# EAGLE design AVRI2CIO_V0_3_LEVEL0 (EAGLE 6.6.0)
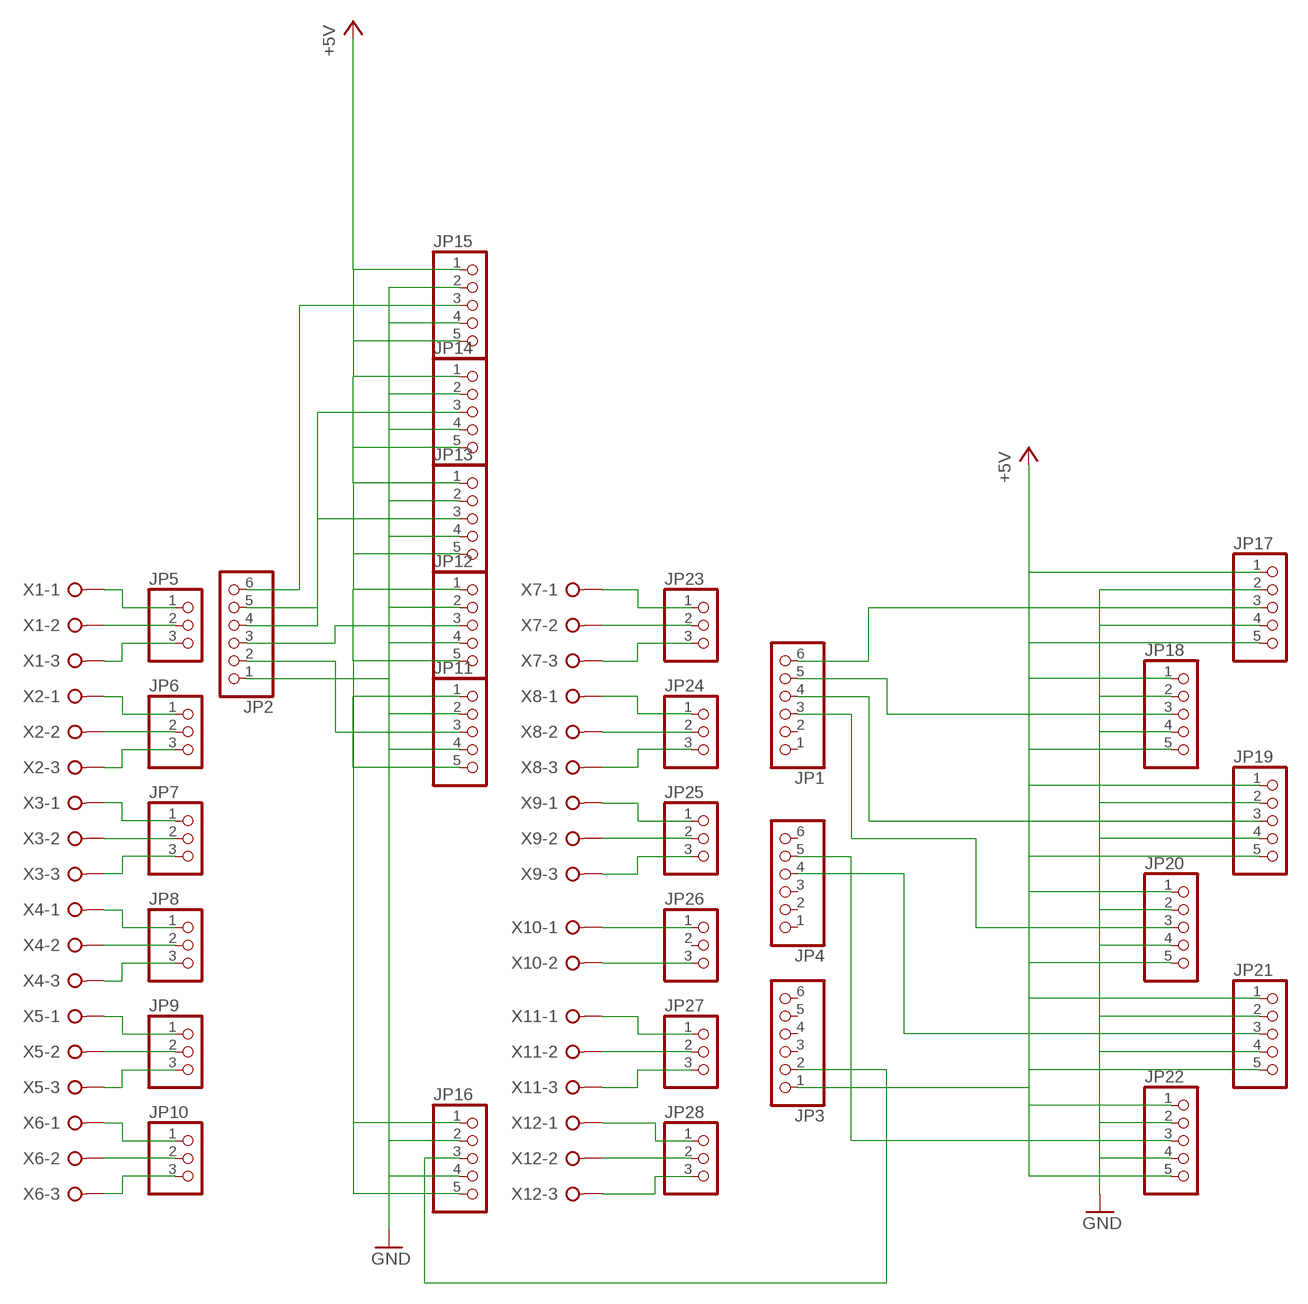
[diagram p0: schematic, sheet 1]

## Parts
JP1  PINHD-1X6  [1X06]
JP2  PINHD-1X6  [1X06]
JP3  PINHD-1X6  [1X06]
JP4  PINHD-1X6  [1X06]
JP5  PINHD-1X3  [1X03]
JP6  PINHD-1X3  [1X03]
JP7  PINHD-1X3  [1X03]
JP8  PINHD-1X3  [1X03]
JP9  PINHD-1X3  [1X03]
JP10  PINHD-1X3  [1X03]
JP11  PINHD-1X5  [1X05]
JP12  PINHD-1X5  [1X05]
JP13  PINHD-1X5  [1X05]
JP14  PINHD-1X5  [1X05]
JP15  PINHD-1X5  [1X05]
JP16  PINHD-1X5  [1X05]
JP17  PINHD-1X5  [1X05]
JP18  PINHD-1X5  [1X05]
JP19  PINHD-1X5  [1X05]
JP20  PINHD-1X5  [1X05]
JP21  PINHD-1X5  [1X05]
JP22  PINHD-1X5  [1X05]
JP23  PINHD-1X3  [1X03]
JP24  PINHD-1X3  [1X03]
JP25  PINHD-1X3  [1X03]
JP26  PINHD-1X3  [1X03]
JP27  PINHD-1X3  [1X03]
JP28  PINHD-1X3  [1X03]
X1  W237-3E  [W237-3E]
X2  W237-3E  [W237-3E]
X3  W237-3E  [W237-3E]
X4  W237-3E  [W237-3E]
X5  W237-3E  [W237-3E]
X6  W237-3E  [W237-3E]
X7  W237-3E  [W237-3E]
X8  W237-3E  [W237-3E]
X9  W237-3E  [W237-3E]
X10  W237-02P  [W237-132]
X11  W237-3E  [W237-3E]
X12  W237-3E  [W237-3E]

## Nets
+5V: JP3.1 JP11.1 JP11.5 JP12.1 JP12.5 JP13.1 JP13.5 JP14.1 JP14.5 JP15.1 JP15.5 JP16.1 JP16.5 JP17.1 JP17.5 JP18.1 JP18.5 JP19.1 JP19.5 JP20.1 JP20.5 JP21.1 JP21.5 JP22.1 JP22.5
GND: JP2.1 JP11.2 JP11.4 JP12.2 JP12.4 JP13.2 JP13.4 JP14.2 JP14.4 JP15.2 JP15.4 JP16.2 JP16.4 JP17.2 JP17.4 JP18.2 JP18.4 JP19.2 JP19.4 JP20.2 JP20.4 JP21.2 JP21.4 JP22.2 JP22.4
N$1: JP2.2 JP11.3
N$2: JP2.3 JP12.3
N$3: JP1.4 JP19.3
N$4: JP2.4 JP13.3
N$5: JP2.5 JP14.3
N$6: JP2.6 JP15.3
N$7: JP1.6 JP17.3
N$8: JP1.5 JP18.3
N$9: JP4.5 JP22.3
N$10: JP4.4 JP21.3
N$11: JP3.2 JP16.3
N$12: JP1.3 JP20.3
N$13: JP10.2 X6.2
N$14: JP10.1 X6.1
N$15: JP10.3 X6.3
N$16: JP9.3 X5.3
N$17: JP9.2 X5.2
N$18: JP9.1 X5.1
N$19: JP8.3 X4.3
N$20: JP8.2 X4.2
N$21: JP8.1 X4.1
N$22: JP7.3 X3.3
N$23: JP7.2 X3.2
N$24: JP7.1 X3.1
N$25: JP6.3 X2.3
N$26: JP6.2 X2.2
N$27: JP6.1 X2.1
N$28: JP5.3 X1.3
N$29: JP5.2 X1.2
N$30: JP5.1 X1.1
N$31: JP28.3 X12.3
N$32: JP28.2 X12.2
N$33: JP28.1 X12.1
N$34: JP27.3 X11.3
N$35: JP27.2 X11.2
N$36: JP27.1 X11.1
N$37: JP25.3 X9.3
N$38: JP25.2 X9.2
N$39: JP25.1 X9.1
N$40: JP24.3 X8.3
N$41: JP24.2 X8.2
N$42: JP24.1 X8.1
N$43: JP23.3 X7.3
N$44: JP23.2 X7.2
N$45: JP23.1 X7.1
N$46: JP26.1 X10.1
N$47: JP26.3 X10.2
Unconnected: JP1.1 JP1.2 JP3.3 JP3.4 JP3.5 JP3.6 JP4.1 JP4.2 JP4.3 JP4.6 JP26.2

## Library data of the parts
JP1-JP4 = pinhead:PINHD-1X6: PIN HEADER
JP5-JP10 JP23-JP28 = pinhead:PINHD-1X3: PIN HEADER
JP11-JP22 = pinhead:PINHD-1X5: PIN HEADER
X1-X9 X11 X12 = con-wago-508:W237-3E: WAGO SREW CLAMP; OC_FARNELL: unknown; OC_NEWARK: unknown
X10 = con-wago-508:W237-02P: WAGO SREW CLAMP; OC_FARNELL: unknown; OC_NEWARK: unknown

## Board
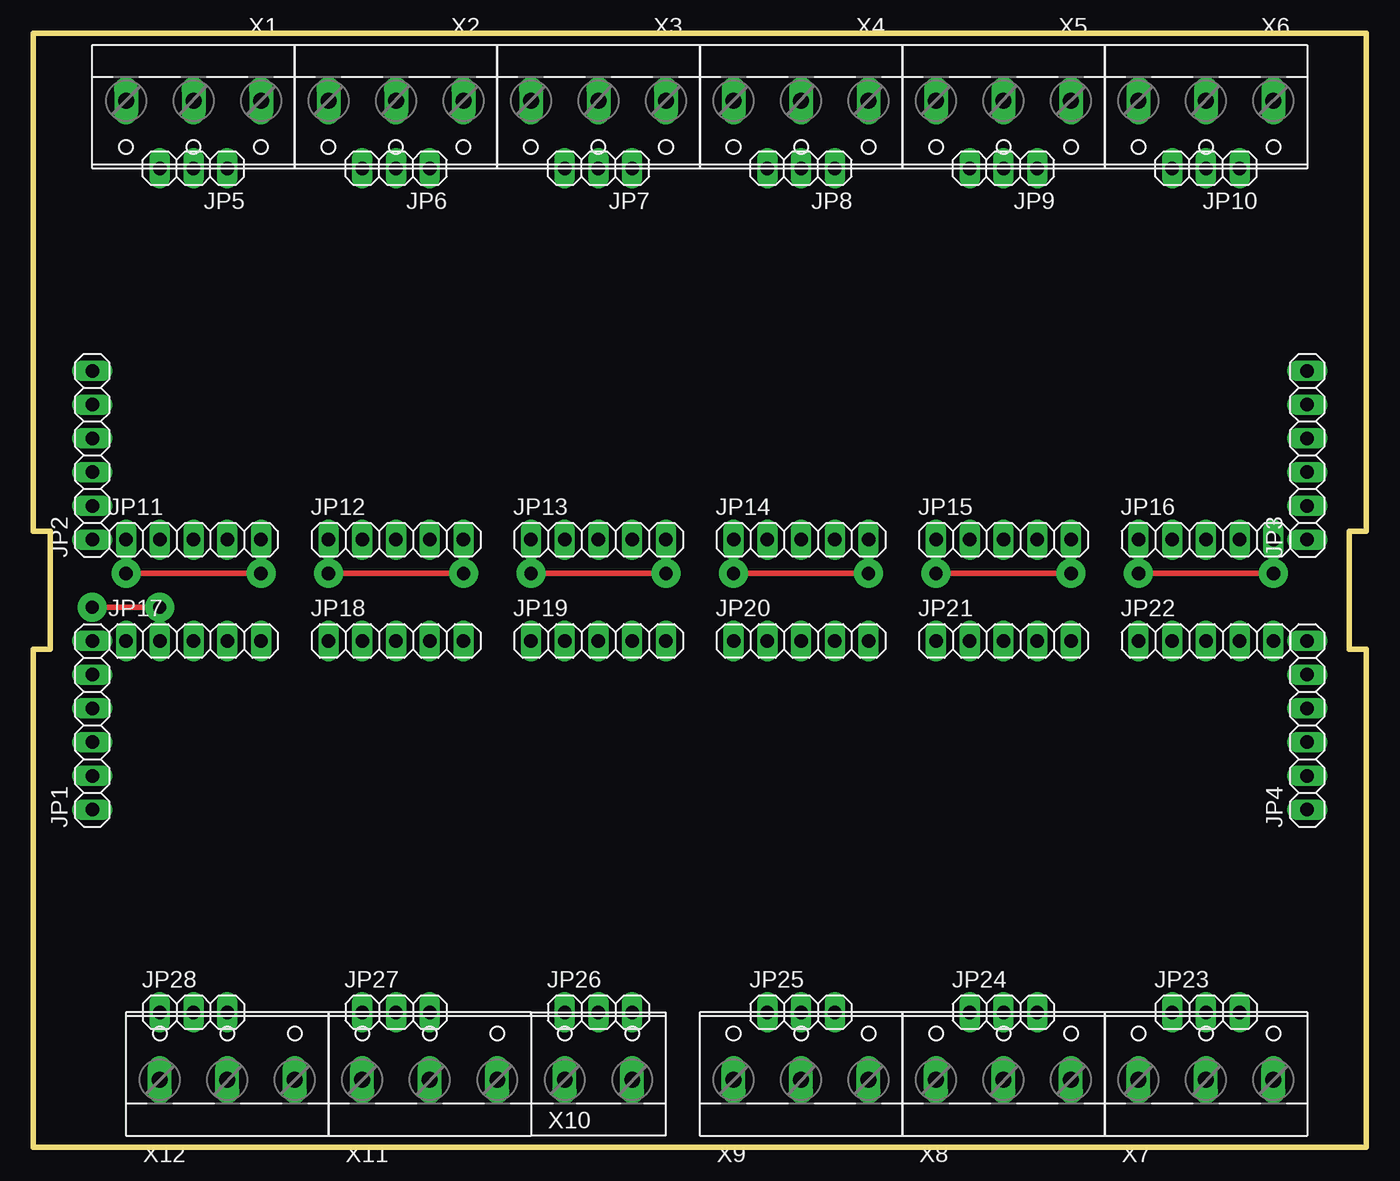
[diagram p1: board, top side]
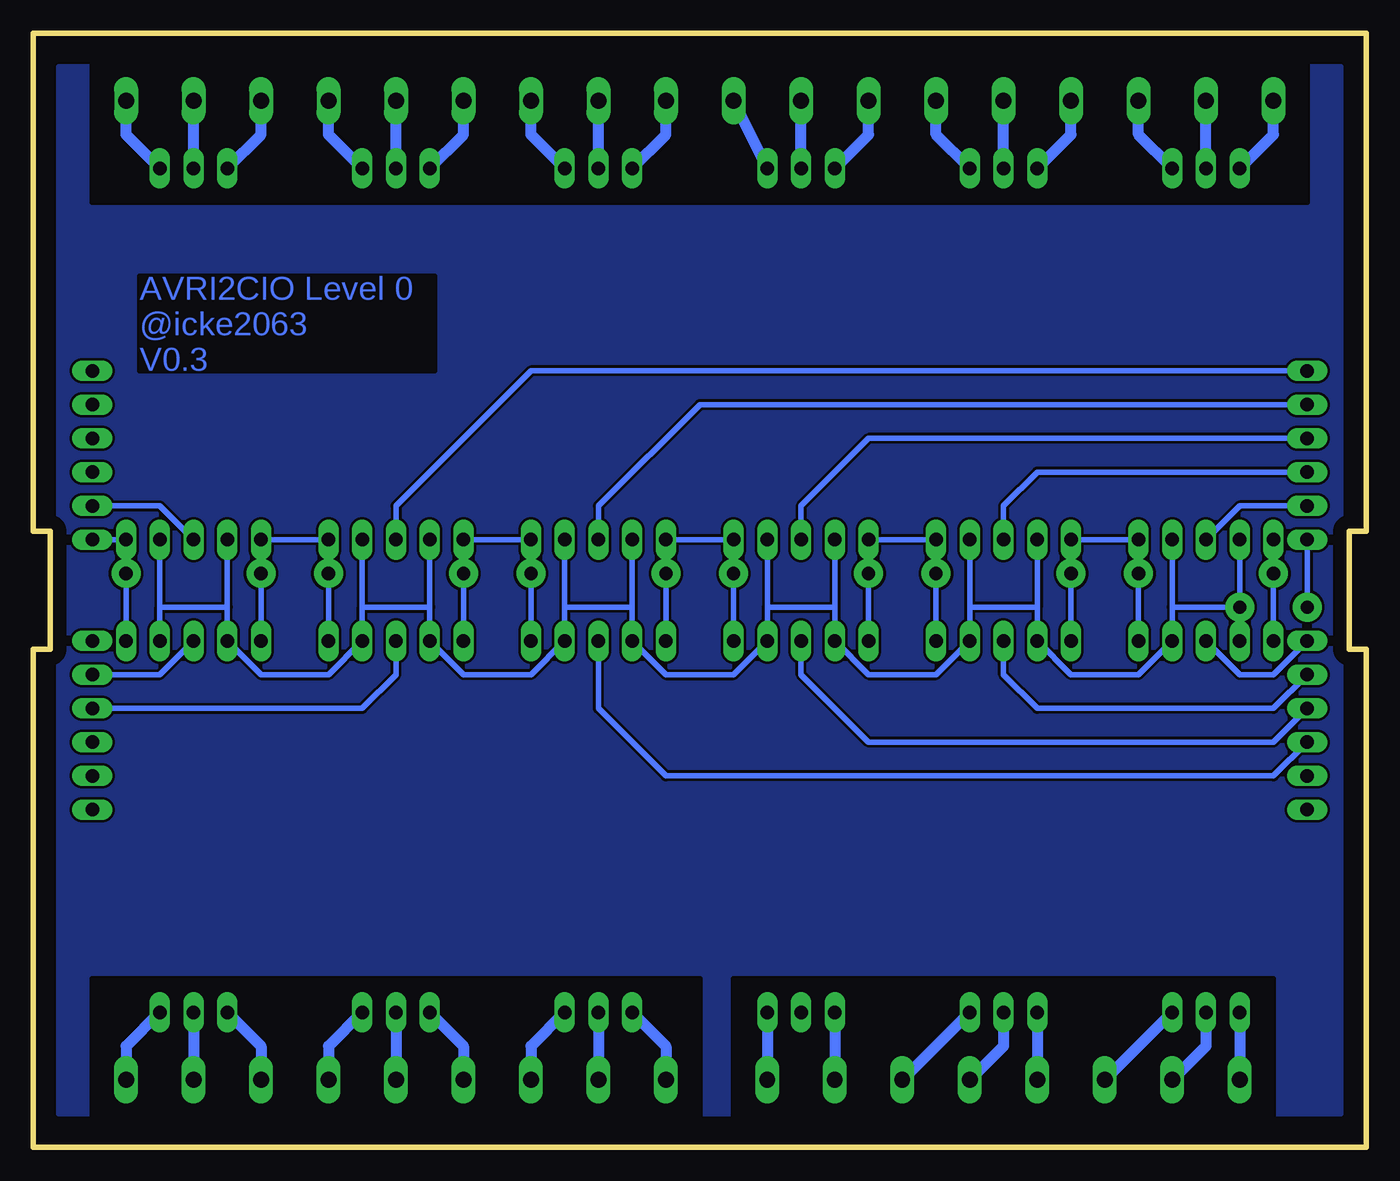
[diagram p2: board, bottom side, seen from below]

Size 100.33 x 83.82 mm. Coordinates in mm from the lower left corner, seen from the top.
Outline: 0,0 100.33,0 100.33,37.47 99.06,37.47 99.06,46.35 100.33,46.35 100.33,83.82 0,83.82 0,46.35 1.27,46.35 1.27,37.47 0,37.47 0,0
Copper layers (1*16): Top 0.035mm / dielectric 1.5mm / Bottom 0.035mm
Design rules "default": minimum track width 10mil, minimum drill 24mil, track to track 8mil, track to pad 8mil, pad to pad 8mil, via to via 8mil, smd to smd 8mil, copper to edge 40mil, drill to drill 8mil, minimum pad ring 10mil, minimum via ring 8mil, stop-mask expansion 4mil, vias tented up to drill 0mil, thermal gap 10mil
bRestrict: area 4.4,71.1 to 19.7,83.8; area 19.7,71.1 to 34.9,83.8; area 34.9,71.1 to 50.2,83.8; area 50.2,71.1 to 65.4,83.8; area 65.4,71.1 to 80.6,83.8; area 80.6,71.1 to 95.9,83.8; area 7,0 to 22.2,12.7; area 22.2,0 to 37.5,12.7; area 37.5,0 to 47.6,12.7; area 50.2,0 to 65.4,12.7; area 65.4,0 to 80.6,12.7; area 80.6,0 to 95.9,12.7

### Footprints (pad centres in the part's own frame; a part is rotated, then mirrored left to right if it is on the bottom)
1X06 = drill 1.016 long: 1 -6.35,0; 2 -3.81,0; 3 -1.27,0; 4 1.27,0; 5 3.81,0; 6 6.35,0
1X03 = drill 1.016 long: 1 -2.54,0; 2 0,0; 3 2.54,0
1X05 = drill 1.016 long: 1 -5.08,0; 2 -2.54,0; 3 0,0; 4 2.54,0; 5 5.08,0
W237-3E = drill 1.194 long: 1 -5.08,-0.635; 2 0,-0.635; 3 5.08,-0.635
W237-132 = drill 1.194 long: 1 -2.54,-0.635; 2 2.54,-0.635

### Placement (x,y rotation side)
JP1  4.45,31.75 90 top
JP2  4.45,52.07 90 top
JP3  95.88,52.07 90 top
JP4  95.88,31.75 90 top
JP5  12.06,73.66 180 top
JP6  27.3,73.66 180 top
JP7  42.55,73.66 180 top
JP8  57.79,73.66 180 top
JP9  73.02,73.66 180 top
JP10  88.27,73.66 180 top
JP11  12.06,45.72 0 top
JP12  27.3,45.72 0 top
JP13  42.55,45.72 0 top
JP14  57.79,45.72 0 top
JP15  73.02,45.72 0 top
JP16  88.27,45.72 0 top
JP17  12.06,38.1 0 top
JP18  27.3,38.1 0 top
JP19  42.55,38.1 0 top
JP20  57.79,38.1 0 top
JP21  73.02,38.1 0 top
JP22  88.27,38.1 0 top
JP23  88.27,10.16 0 top
JP24  73.02,10.16 0 top
JP25  57.79,10.16 0 top
JP26  42.55,10.16 0 top
JP27  27.3,10.16 0 top
JP28  12.06,10.16 0 top
X1  12.06,78.11 180 top
X2  27.3,78.11 180 top
X3  42.55,78.11 180 top
X4  57.79,78.11 180 top
X5  73.02,78.11 180 top
X6  88.27,78.11 180 top
X7  88.27,5.71 0 top
X8  73.02,5.71 0 top
X9  57.79,5.71 0 top
X10  42.55,5.71 0 top
X11  29.84,5.71 0 top
X12  14.61,5.71 0 top

### Tracks (layer width: path | path; a pad name or v marks a point on that pad's centre or on a via)
+5V  (via drill 1 pad 2.18)
  Top 0.406: v6.99,43.18 v17.14,43.18 | v32.39,43.18 v22.22,43.18 | v37.47,43.18 v47.62,43.18 | v52.71,43.18 v62.87,43.18 | v67.94,43.18 v78.1,43.18 | v83.18,43.18 v93.34,43.18
  Bottom 0.406: JP17.5 v17.14,43.18 JP11.5 JP12.1 v22.22,43.18 JP18.1 | JP19.5 v47.62,43.18 JP13.5 JP14.1 v52.71,43.18 JP20.1 | JP20.5 v62.87,43.18 JP14.5 JP15.1 v67.94,43.18 JP21.1 | JP21.5 v78.1,43.18 JP15.5 JP16.1 v83.18,43.18 JP22.1 | JP22.5 v93.34,43.18 JP16.5 JP3.1 | JP18.5 v32.39,43.18 JP12.5 JP13.1 v37.47,43.18 JP19.1 | JP17.1 v6.99,43.18 JP11.1
GND  (via drill 1 pad 2.18)
  Top 0.406: v4.45,40.64 v9.53,40.64
  Bottom 0.406: JP17.2 v9.53,40.64 | v9.53,40.64 14.61,40.64 | 14.61,40.64 JP17.4 17.14,35.56 22.22,35.56 JP18.2 24.76,40.64 | 24.76,40.64 29.84,40.64 | 29.84,40.64 JP12.4 | 29.84,40.64 JP18.4 32.39,35.56 37.47,35.56 JP19.2 40.01,40.64 | JP12.2 24.76,40.64 | JP13.2 40.01,40.64 | 45.09,40.64 JP19.4 47.62,35.56 52.71,35.56 JP20.2 55.25,40.64 | JP13.4 45.09,40.64 | 45.09,40.64 40.01,40.64 | JP11.4 14.61,40.64 | JP11.2 v9.53,40.64 | JP14.2 55.25,40.64 | 55.25,40.64 60.33,40.64 | 70.48,40.64 JP15.2 | JP15.4 75.56,40.64 | 75.56,40.64 JP21.4 78.1,35.56 83.18,35.56 JP22.2 85.72,40.64 | 75.56,40.64 70.48,40.64 | 85.72,40.64 JP16.2 | JP22.4 90.8,40.64 | JP16.4 90.8,40.64 | 90.8,40.64 85.72,40.64 | 70.48,40.64 JP21.2 67.94,35.56 62.87,35.56 JP20.4 60.33,40.64 | JP2.1 v4.45,40.64 | JP14.4 60.33,40.64
N$1
  Bottom 0.406: JP2.2 9.53,48.26 JP11.3
N$2
  Bottom 0.406: JP2.3 24.76,50.8 27.3,48.26 JP12.3
N$3
  Bottom 0.406: JP1.4 6.99,30.48 37.47,30.48 42.55,35.56 JP19.3
N$4
  Bottom 0.406: JP2.4 37.47,53.34 42.55,48.26 JP13.3
N$5
  Bottom 0.406: JP2.5 50.16,55.88 57.79,48.26 JP14.3
N$6
  Bottom 0.406: JP2.6 62.87,58.42 73.02,48.26 JP15.3
N$7
  Bottom 0.406: JP1.6 6.99,35.56 9.53,35.56 JP17.3
N$8
  Bottom 0.406: JP1.5 6.99,33.02 24.76,33.02 27.3,35.56 JP18.3
N$9
  Bottom 0.406: JP4.5 90.8,35.56 JP22.3
N$10
  Bottom 0.406: JP4.4 75.56,33.02 73.02,35.56 JP21.3
N$11
  Bottom 0.406: JP3.2 90.8,48.26 JP16.3
N$12
  Bottom 0.406: JP1.3 6.99,27.94 52.71,27.94 57.79,33.02 JP20.3
N$13
  Bottom 0.813: JP10.2 X6.2
N$14
  Bottom 0.813: JP10.1 93.34,76.2 X6.1
N$15
  Bottom 0.813: JP10.3 83.18,76.2 X6.3
N$16
  Bottom 0.813: JP9.3 67.94,76.2 X5.3
N$17
  Bottom 0.813: JP9.2 X5.2
N$18
  Bottom 0.813: JP9.1 78.1,76.2 X5.1
N$19
  Bottom 0.813: JP8.3 52.71,76.2 X4.3
N$20
  Bottom 0.813: JP8.2 X4.2
N$21
  Bottom 0.813: JP8.1 62.87,76.2 X4.1
N$22
  Bottom 0.813: JP7.3 37.47,76.2 X3.3
N$23
  Bottom 0.813: JP7.2 X3.2
N$24
  Bottom 0.813: JP7.1 X3.1
N$25
  Bottom 0.813: JP6.3 22.22,76.2 X2.3
N$26
  Bottom 0.813: JP6.2 X2.2
N$27
  Bottom 0.813: JP6.1 32.39,76.2 X2.1
N$28
  Bottom 0.813: JP5.3 6.99,76.2 X1.3
N$29
  Bottom 0.813: JP5.2 X1.2
N$30
  Bottom 0.813: JP5.1 17.14,76.2 X1.1
N$31
  Bottom 0.813: JP28.3 X12.3
N$32
  Bottom 0.813: JP28.2 12.06,7.62 X12.2
N$33
  Bottom 0.813: JP28.1 X12.1
N$34
  Bottom 0.813: JP27.3 X11.3
N$35
  Bottom 0.813: JP27.2 27.3,7.62 X11.2
N$36
  Bottom 0.813: JP27.1 X11.1
N$37
  Bottom 0.813: JP25.3 62.87,7.62 X9.3
N$38
  Bottom 0.813: JP25.2 X9.2
N$39
  Bottom 0.813: JP25.1 52.71,7.62 X9.1
N$40
  Bottom 0.813: JP24.3 78.1,7.62 X8.3
N$41
  Bottom 0.813: JP24.2 X8.2
N$42
  Bottom 0.813: JP24.1 67.94,7.62 X8.1
N$43
  Bottom 0.813: JP23.3 93.34,7.62 X7.3
N$44
  Bottom 0.813: JP23.2 X7.2
N$45
  Bottom 0.813: JP23.1 83.18,7.62 X7.1
N$46
  Bottom 0.813: JP26.1 X10.1
N$47
  Bottom 0.813: JP26.3 X10.2
N$48
  pour Bottom: 1.91,2.54 1.91,81.28 98.42,81.28 98.42,2.54

### Text on the board
Bottom: AVRI2CIO Level 0 / @icke2063 / V0.3